# Altium schematic sheet micro.SchDoc
size A
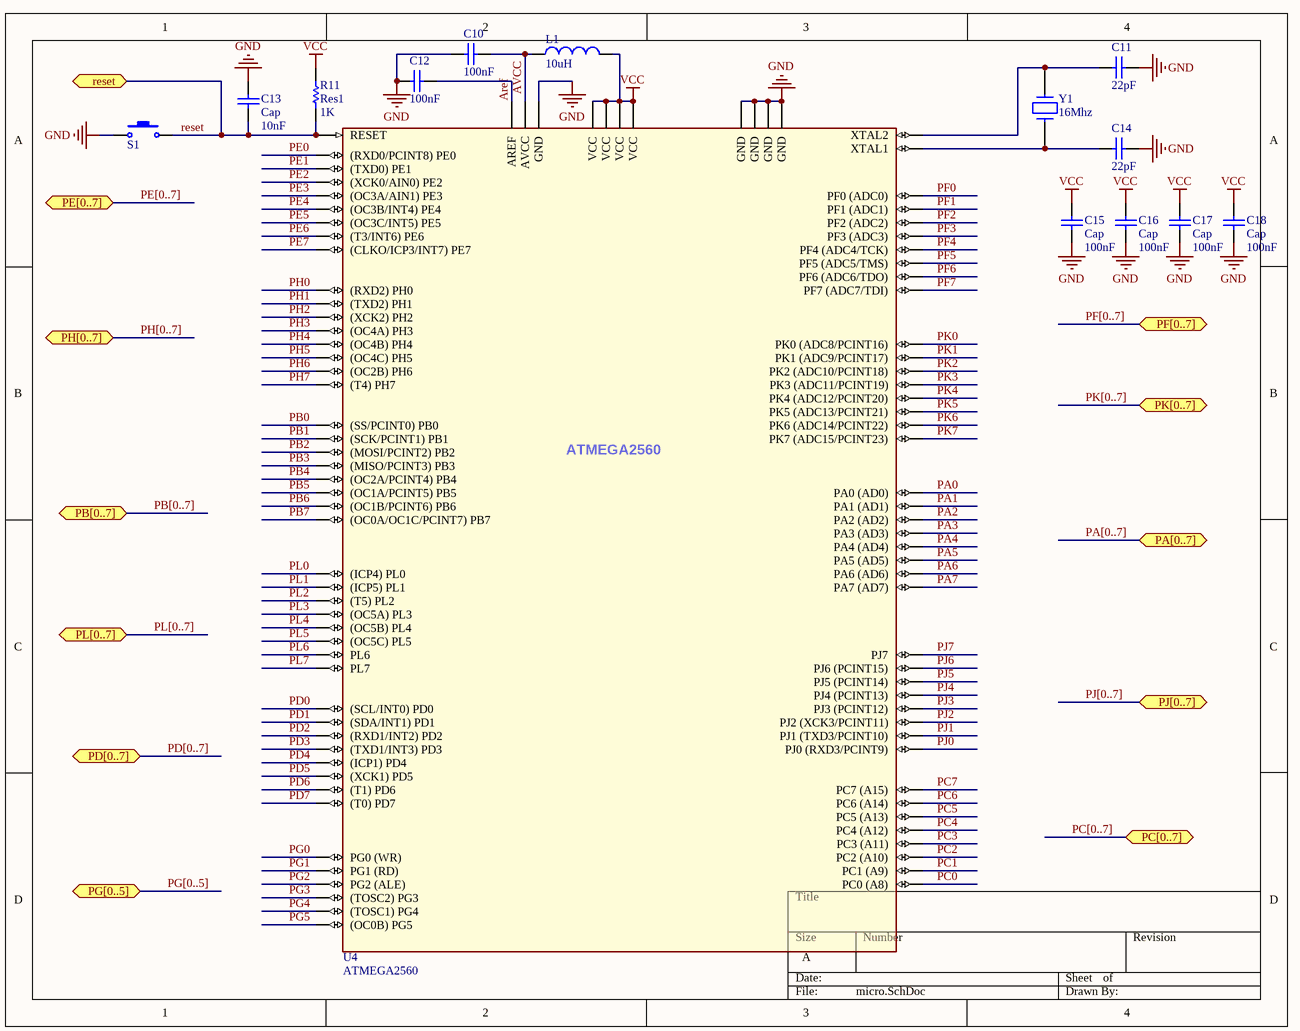
[diagram p0: micro.SchDoc]

## Parts
C10  value 100nF  [CAP 1206 (3216X15L)]  (hidden comment: Cap)
C11  value 22pF  [CAP 1206 (3216X15L)]  (hidden comment: Cap)
C12  value 100nF  [CAP 1206 (3216X15L)]  (hidden comment: Cap)
C13  Cap  value 10nF  [CAP 1206 (3216X15L)]
C14  value 22pF  [CAP 1206 (3216X15L)]  (hidden comment: Cap)
C15  Cap  value 100nF  [CAP 1206 (3216X15L)]
C16  Cap  value 100nF  [CAP 1206 (3216X15L)]
C17  Cap  value 100nF  [CAP 1206 (3216X15L)]
C18  Cap  value 100nF  [CAP 1206 (3216X15L)]
L1  value 10uH  [IND1206]  (hidden comment: Inductor)
R11  Res1  value 1K  [RES 1206 (3216X08L)]
S1  Switch PB  [Switch - Push to On]  (value not drawn)
U4  ATMEGA2560  [MY_ATMEGA2560]
Y1  16Mhz  [My_Crystal]

## Ports
PA[0..7] (bidir), PB[0..7] (bidir), PC[0..7] (bidir), PD[0..7] (bidir), PE[0..7] (bidir), PF[0..7] (bidir), PG[0..5] (bidir), PH[0..7] (bidir), PJ[0..7] (bidir), PK[0..7] (bidir), PL[0..7] (bidir), reset (bidir)

## Nets
GND: C10.1 C11.2 C12.1 C13.2 C14.2 C15.1 C16.1 C17.1 C18.1 S1.1 U4.11(GND) U4.32(GND) U4.62(GND) U4.81(GND) U4.99(GND)
VCC: C15.2 C16.2 C17.2 C18.2 L1.2 R11.2 U4.10(VCC) U4.31(VCC) U4.61(VCC) U4.80(VCC)
Aref: C12.2 U4.98(AREF)
AVCC: C10.2 L1.1 U4.100(AVCC)
PA0: U4.78(PA0_(AD0))
PA1: U4.77(PA1_(AD1))
PA2: U4.76(PA2_(AD2))
PA3: U4.75(PA3_(AD3))
PA4: U4.74(PA4_(AD4))
PA5: U4.73(PA5_(AD5))
PA6: U4.72(PA6_(AD6))
PA7: U4.71(PA7_(AD7))
PB0: U4.19((SS/PCINT0)_PB0)
PB1: U4.20((SCK/PCINT1)_PB1)
PB2: U4.21((MOSI/PCINT2)_PB2)
PB3: U4.22((MISO/PCINT3)_PB3)
PB4: U4.23((OC2A/PCINT4)_PB4)
PB5: U4.24((OC1A/PCINT5)_PB5)
PB6: U4.25((OC1B/PCINT6)_PB6)
PB7: U4.26((OC0A/OC1C/PCINT7)_PB7)
PC0: U4.53(PC0_(A8))
PC1: U4.54(PC1_(A9))
PC2: U4.55(PC2_(A10))
PC3: U4.56(PC3_(A11))
PC4: U4.57(PC4_(A12))
PC5: U4.58(PC5_(A13))
PC6: U4.59(PC6_(A14))
PC7: U4.60(PC7_(A15))
PD0: U4.43((SCL/INT0)_PD0)
PD1: U4.44((SDA/INT1)_PD1)
PD2: U4.45((RXD1/INT2)_PD2)
PD3: U4.46((TXD1/INT3)_PD3)
PD4: U4.47((ICP1)_PD4)
PD5: U4.48((XCK1)_PD5)
PD6: U4.49((T1)_PD6)
PD7: U4.50((T0)_PD7)
PE0: U4.2((RXD0/PCINT8)_PE0)
PE1: U4.3((TXD0)_PE1)
PE2: U4.4((XCK0/AIN0)_PE2)
PE3: U4.5((OC3A/AIN1)_PE3)
PE4: U4.6((OC3B/INT4)_PE4)
PE5: U4.7((OC3C/INT5)_PE5)
PE6: U4.8((T3/INT6)_PE6)
PE7: U4.9((CLKO/ICP3/INT7)_PE7)
PF0: U4.97(PF0_(ADC0))
PF1: U4.96(PF1_(ADC1))
PF2: U4.95(PF2_(ADC2))
PF3: U4.94(PF3_(ADC3))
PF4: U4.93(PF4_(ADC4/TCK))
PF5: U4.92(PF5_(ADC5/TMS))
PF6: U4.91(PF6_(ADC6/TDO))
PF7: U4.90(PF7_(ADC7/TDI))
PG0: U4.51(PG0_(WR))
PG1: U4.52(PG1_(RD))
PG2: U4.70(PG2_(ALE))
PG3: U4.28((TOSC2)_PG3)
PG4: U4.29((TOSC1)_PG4)
PG5: U4.1((OC0B)_PG5)
PH0: U4.12((RXD2)_PH0)
PH1: U4.13((TXD2)_PH1)
PH2: U4.14((XCK2)_PH2)
PH3: U4.15((OC4A)_PH3)
PH4: U4.16((OC4B)_PH4)
PH5: U4.17((OC4C)_PH5)
PH6: U4.18((OC2B)_PH6)
PH7: U4.27((T4)_PH7)
PJ0: U4.63(PJ0_(RXD3/PCINT9))
PJ1: U4.64(PJ1_(TXD3/PCINT10))
PJ2: U4.65(PJ2_(XCK3/PCINT11))
PJ3: U4.66(PJ3_(PCINT12))
PJ4: U4.67(PJ4_(PCINT13))
PJ5: U4.68(PJ5_(PCINT14))
PJ6: U4.69(PJ6_(PCINT15))
PJ7: U4.79(PJ7)
PK0: U4.89(PK0_(ADC8/PCINT16))
PK1: U4.88(PK1_(ADC9/PCINT17))
PK2: U4.87(PK2_(ADC10/PCINT18))
PK3: U4.86(PK3_(ADC11/PCINT19))
PK4: U4.85(PK4_(ADC12/PCINT20))
PK5: U4.84(PK5_(ADC13/PCINT21))
PK6: U4.83(PK6_(ADC14/PCINT22))
PK7: U4.82(PK7_(ADC15/PCINT23))
PL0: U4.35((ICP4)_PL0)
PL1: U4.36((ICP5)_PL1)
PL2: U4.37((T5)_PL2)
PL3: U4.38((OC5A)_PL3)
PL4: U4.39((OC5B)_PL4)
PL5: U4.40((OC5C)_PL5)
PL6: U4.41(PL6)
PL7: U4.42(PL7)
reset: C13.1 R11.1 S1.2 U4.30(RESET) ; port reset
NetC11_1: C11.1 U4.33(XTAL2) Y1.2
NetC14_1: C14.1 U4.34(XTAL1) Y1.1

## Buses and harness runs
bus PA[0..7] = port PA[0..7]
bus PB[0..7] = port PB[0..7]
bus PC[0..7] = port PC[0..7]
bus PD[0..7] = port PD[0..7]
bus PE[0..7] = port PE[0..7]
bus PF[0..7] = port PF[0..7]
bus PG[0..5] = port PG[0..5]
bus PH[0..7] = port PH[0..7]
bus PJ[0..7] = port PJ[0..7]
bus PK[0..7] = port PK[0..7]
bus PL[0..7] = port PL[0..7]

## Library data of the parts
C10-C18 = Cap ceramic: CAP-100Nf
L1 = Inductor: Code_IEC: 1005; Published: 8-Jun-2000; LatestRevisionDate: 29-May-2009; LatestRevisionNote: IPC-7351 Footprint Added.; PackageReference: 0402-A; Publisher: Altium Limited; PackageDescription: Chip Inductor; Code_JEITA: 0402
R11 = Res1: Resistor; Published: 8-Jun-2000; LatestRevisionDate: 17-Jul-2002; LatestRevisionNote: Re-released for DXP Platform.; PackageReference: AXIAL-0.3; Publisher: Altium Limited; PackageDescription: Axial Device, Thru-Hole; 2 Leads; 0.3 in Pin Spacing
S1 = Switch PB: Push Button Switch
U4 = ATMEGA2560: AVR 256K Bytes of In-System Programmable Flash Memory
Y1 = CRYSTAL